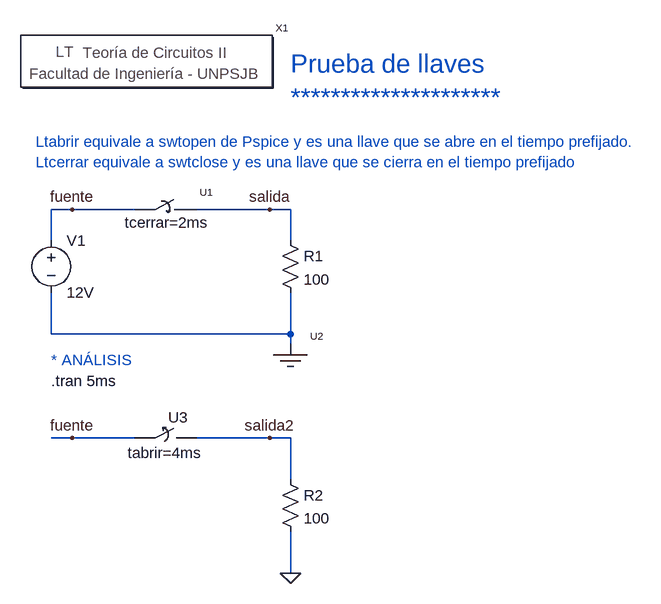
[diagram p0: schematic Para probar las llaves.asc]
Para probar las llaves.asc, the LTspice schematic file:
Version 4
SHEET 1 1108 680
WIRE -32 -80 -64 -80
WIRE 64 -80 -32 -80
WIRE 272 -80 160 -80
WIRE 304 -80 272 -80
WIRE -64 -32 -64 -80
WIRE 304 -32 304 -80
WIRE -64 112 -64 48
WIRE 304 112 304 48
WIRE 304 112 -64 112
WIRE 304 128 304 112
WIRE -32 272 -64 272
WIRE 64 272 -32 272
WIRE 272 272 160 272
WIRE 304 272 272 272
WIRE 304 336 304 272
WIRE 304 480 304 416
FLAG -32 -80 fuente
FLAG 272 -80 salida
FLAG 304 480 0
FLAG -32 272 fuente
FLAG 272 272 salida2
SYMBOL voltage -64 -48 R0
SYMATTR InstName V1
SYMATTR Value 12V
SYMBOL res 288 -48 R0
SYMATTR InstName R1
SYMATTR Value 100
SYMBOL res 288 320 R0
SYMATTR InstName R2
SYMATTR Value 100
SYMBOL ltabrir 112 272 R0
WINDOW 39 -1 23 Center 2
SYMATTR SpiceLine tabrir=4ms
SYMATTR InstName U3
SYMBOL ltcerrar 112 -80 R0
SYMATTR InstName U1
SYMATTR SpiceLine tcerrar=2ms
SYMBOL masa 304 144 R0
SYMATTR InstName U2
SYMBOL Circuitos2\\Letreros\\Teoría\ de\ Circuitos\ II 80 -304 R0
SYMATTR InstName X1
TEXT 304 -304 Left 4 ;Prueba de llaves\n*********************
TEXT -64 184 Left 2 !.tran 5ms
TEXT -64 152 Left 2 ;* ANÁLISIS
TEXT -88 -184 Left 2 ;Ltabrir equivale a swtopen de Pspice y es una llave que se abre en el tiempo prefijado.\nLtcerrar equivale a swtclose y es una llave que se cierra en el tiempo prefijado

The netlist it stands for:
* Para probar las llaves.asc
V1 fuente N001 12V
R1 salida N001 100
R2 salida2 0 100
XU3 fuente salida2 Ltabrir tabrir=4ms ttran=1u Rclosed=1m Ropen=1T  ; pins 1 2
XU1 fuente salida Ltcerrar Ltcerrar tcerrar=2ms ttran=1u Rclosed=1m Ropen=1T  ; pins 1 2
XU2 N001 masa masa  ; pins 1
XX1 Teoría de Circuitos II
* Prueba de llaves
* *********************
.tran 5ms
* * ANÁLISIS
* Ltabrir equivale a swtopen de Pspice y es una llave que se abre en el tiempo prefijado.
* Ltcerrar equivale a swtclose y es una llave que se cierra en el tiempo prefijado
.lib ..\sym\Circuitos2\Llaves\llaves.lib
.lib ..\sym\Circuitos2\Fuentes\Fuentes.lib
.backanno
.end